# EAGLE design WFT0750CZ09_conv (EAGLE 7.7.0)
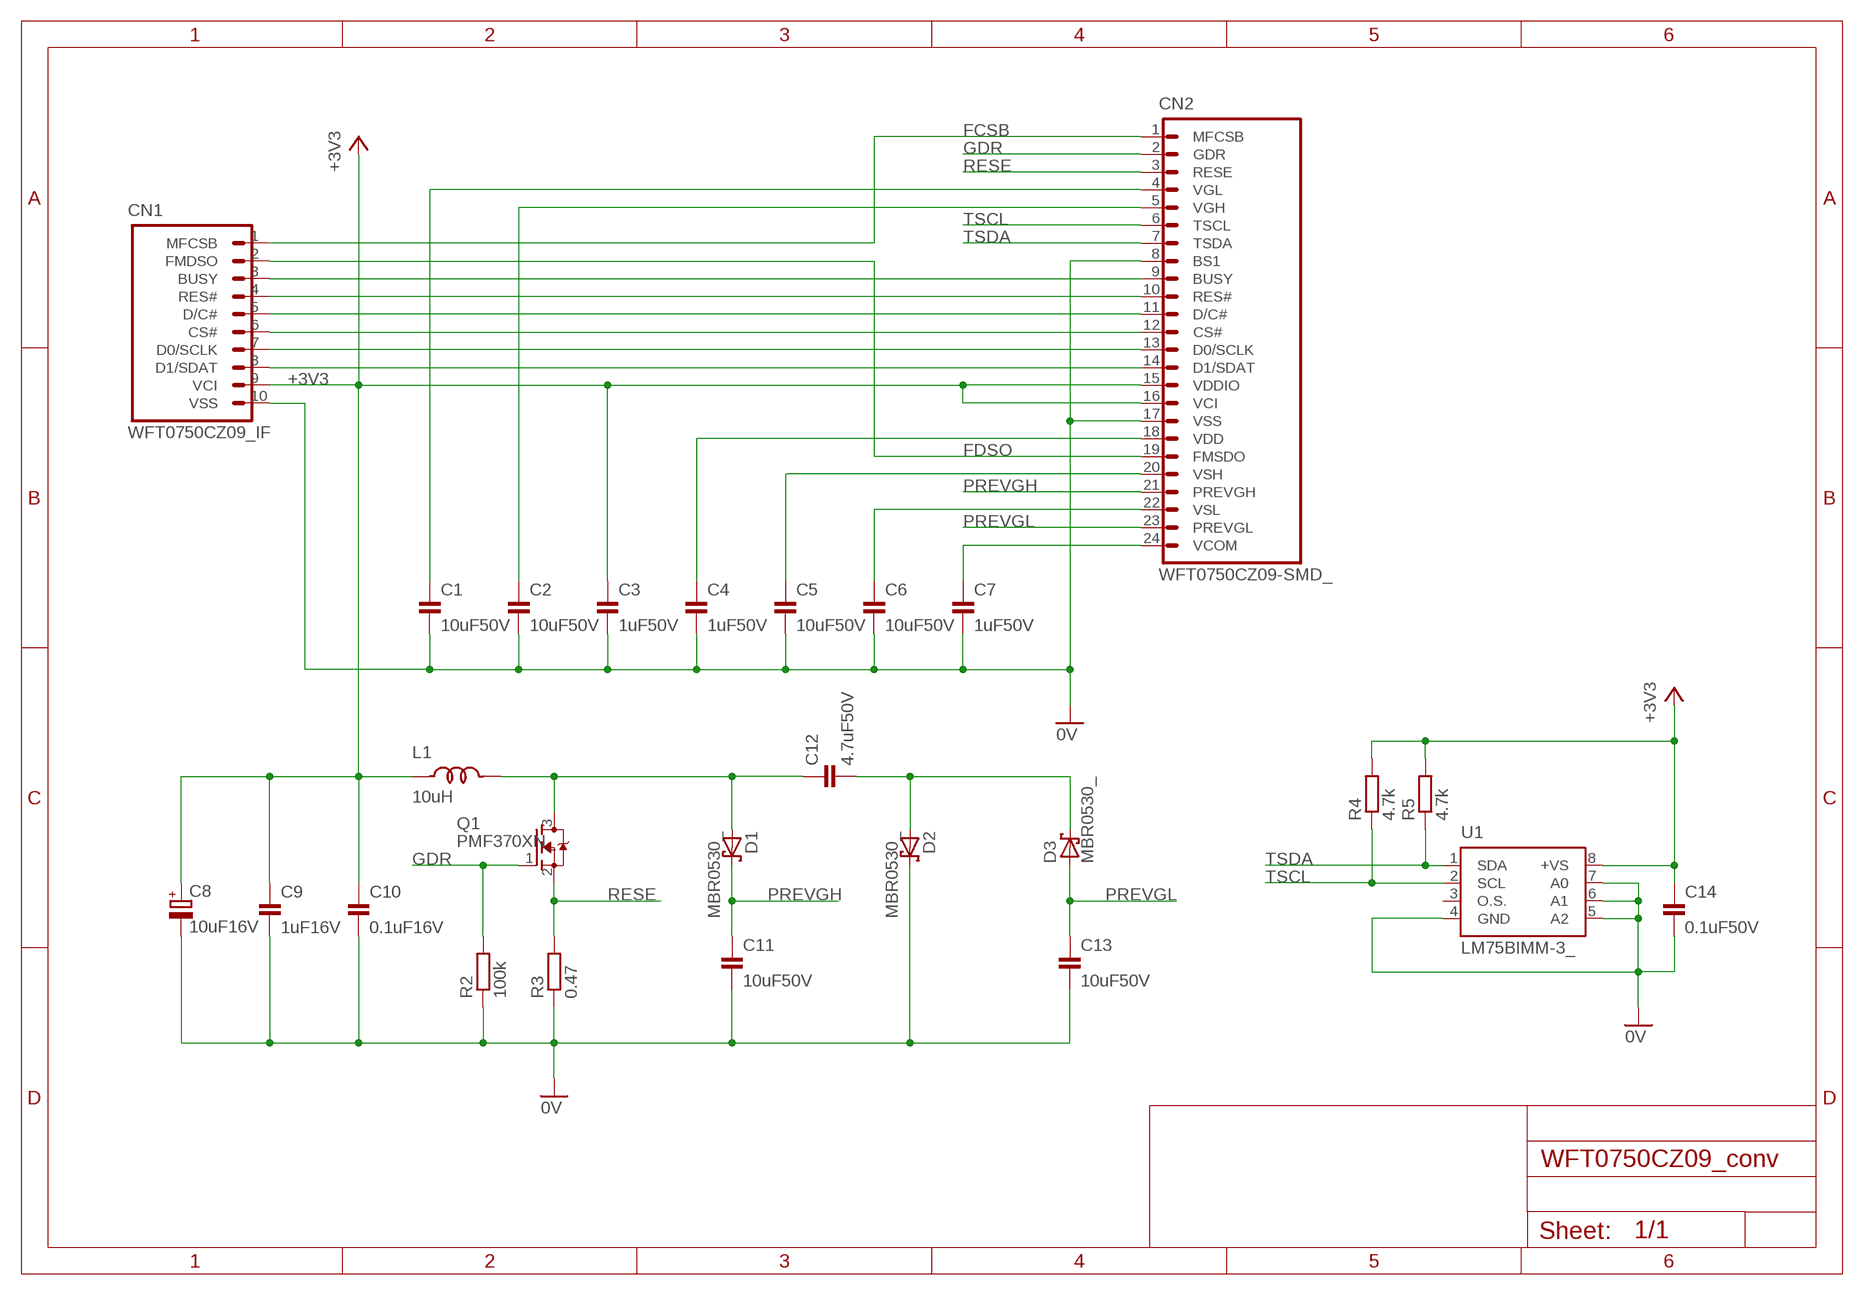
[diagram p0: schematic, sheet 1]

## Parts
C1  10uF50V  CAP_0805  [SMD_2012]
C2  10uF50V  CAP_0805  [SMD_2012]
C3  1uF50V  CAP_0805  [SMD_2012]
C4  1uF50V  CAP_0805  [SMD_2012]
C5  10uF50V  CAP_0805  [SMD_2012]
C6  10uF50V  CAP_0805  [SMD_2012]
C7  1uF50V  CAP_0805  [SMD_2012]
C8  10uF16V  TPST106K016R0800_  [C1210_TPST_DEV]
C9  1uF16V  CAP_0805  [SMD_2012]
C10  0.1uF16V  CAP_0805  [SMD_2012]
C11  10uF50V  CAP_0805  [SMD_2012]
C12  4.7uF50V  CAP_0805  [SMD_2012]
C13  10uF50V  CAP_0805  [SMD_2012]
C14  0.1uF50V  CAP_0805  [SMD_2012]
CN1  WFT0750CZ09_IF  [WFT0750CZ09_IF_10PIN]
CN2  WFT0750CZ09-SMD_  [FH12A-24S-0.5SH_DEV]
D1  MBR0530_  [MBR0530_DEV]
D2  MBR0530_  [MBR0530_DEV]
D3  MBR0530_  [MBR0530_DEV]
L1  10uH  NLCV25T_  [NLCV25T_DEV]
Q1  PMF370XN_  [SOT323_DEV]
R2  100k  RESISTOR_0805  [SMD_2012]
R3  0.47  RESISTOR_0805  [SMD_2012]
R4  4.7k  RESISTOR_0805  [SMD_2012]
R5  4.7k  RESISTOR_0805  [SMD_2012]
U1  LM75BIMM-3_  [SSOP8-DGK_DEV]

## Nets
0V: C1.2 C2.2 C3.2 C4.2 C5.2 C6.2 C7.2 C8.2(-) C9.2 C10.2 C11.2 C13.2 C14.2 CN1.10(VSS) CN2.8(BS1) CN2.17(VSS) D2.1(C) R2.1 R3.1 U1.4(GND) U1.5(A2) U1.6(A1) U1.7(A0)
+3V3: C3.1 C8.1(+) C9.1 C10.1 C14.1 CN1.9(VCI) CN2.15(VDDIO) CN2.16(VCI) L1.1 R4.2 R5.2 U1.8(+VS)
FCSB: CN1.1(MFCSB) CN2.1(MFCSB)
FDSO: CN1.2(FMDSO) CN2.19(FMSDO)
GDR: CN2.2(GDR) Q1.1(G) R2.2
N$1: C7.1 CN2.24(VCOM)
N$2: C6.1 CN2.22(VSL)
N$3: C5.1 CN2.20(VSH)
N$5: C4.1 CN2.18(VDD)
N$6: C12.1 D1.2(A) L1.2 Q1.3(D)
N$7: C2.1 CN2.5(VGH)
N$8: C1.1 CN2.4(VGL)
N$9: CN1.3(BUSY) CN2.9(BUSY)
N$10: CN1.4(RES#) CN2.10(RES#)
N$11: CN1.5(D/C#) CN2.11(D/C#)
N$12: CN1.6(CS#) CN2.12(CS#)
N$13: CN1.7(D0/SCLK) CN2.13(D0/SCLK)
N$14: CN1.8(D1/SDAT) CN2.14(D1/SDAT)
N$15: C12.2 D2.2(A) D3.1(C)
PREVGH: C11.1 CN2.21(PREVGH) D1.1(C)
PREVGL: C13.1 CN2.23(PREVGL) D3.2(A)
RESE: CN2.3(RESE) Q1.2(S) R3.2
TSCL: CN2.6(TSCL) R4.1 U1.2(SCL)
TSDA: CN2.7(TSDA) R5.1 U1.1(SDA)
Unconnected: U1.3(O.S.)

## Library data of the parts
C1-C7 C9-C14 = Parts:CAP: コンデンサー
C8 = Parts:TPST*: タンタルコンデンサ TPST106K016R0800 10µF ±10% 16V ESR（等価直列抵抗）: 0.8オーム 動作温度 : -55°C～125°C サイズ : 3.50mm x 2.80mm
CN1 = PartsForProto:WFT0750CZ09_IF: WF0420CZ15変換基板用I/F
CN2 = PartsForProto:WFT0750CZ09: インターフェースピン
D1-D3 = Parts:MBR0530: ショットキーダイオード
L1 = Parts:NLCV*: LEAD INDUCTOR
Q1 = Parts:PMF370XN: N-Channel 30 V (D-S) MOSFET
R2-R5 = Parts:RESISTOR: 抵抗器
U1 = Parts:LM75B*: 基板取付型温度センサー

## Board
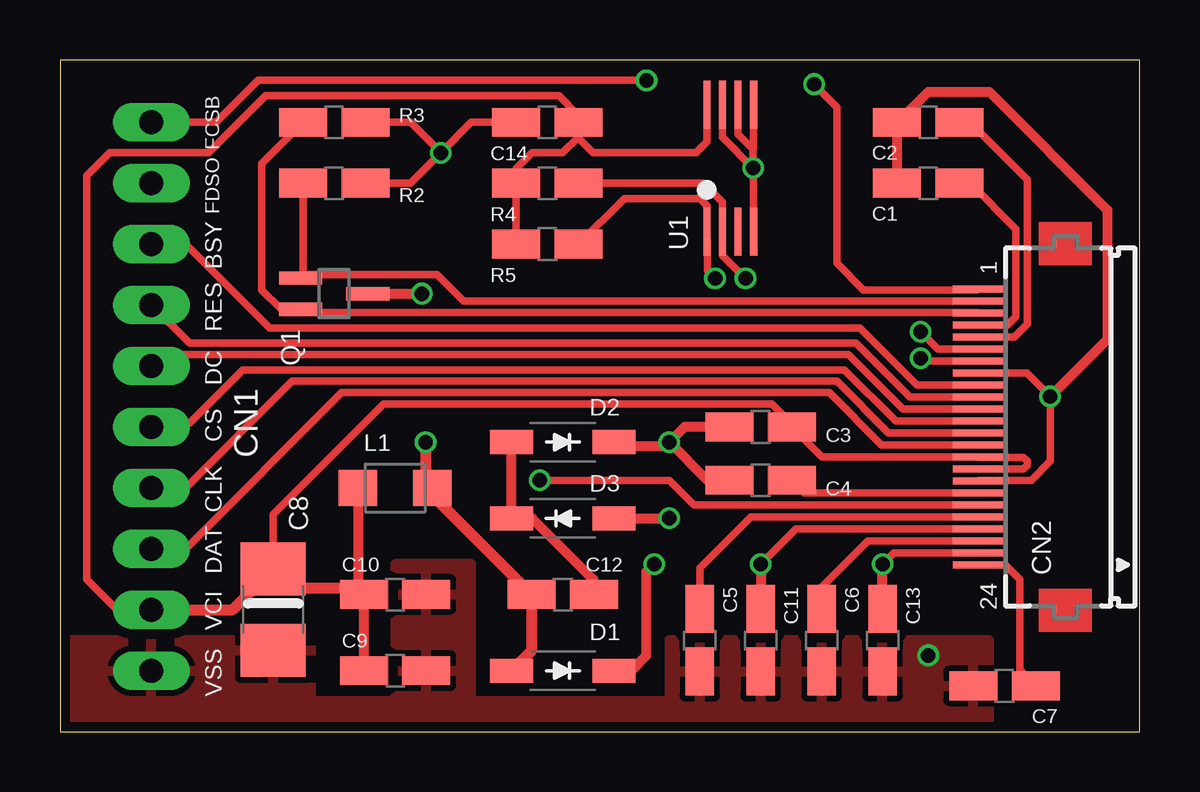
[diagram p1: board, top side]
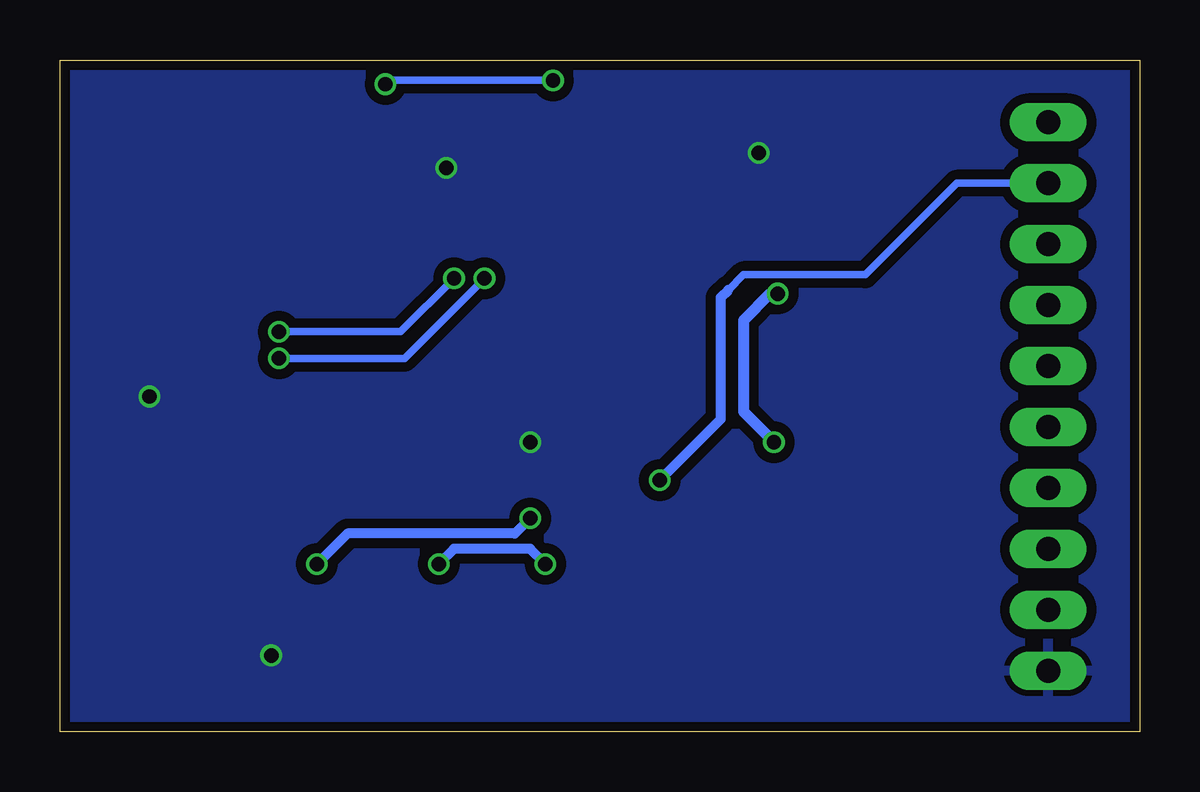
[diagram p2: board, bottom side, seen from below]

Size 45 x 28 mm. Coordinates in mm from the lower left corner, seen from the top.
Outline: 0,0 45,0 45,28 0,28 0,0
Copper layers (1*16): Top 0.035mm / dielectric 1.5mm / Bottom 0.035mm
Design rules "SeeedStudio_2layer_DRU_no_angle_20140221": minimum track width 6mil, minimum drill 12mil, track to track 6mil, track to pad 6mil, pad to pad 6mil, via to via 6mil, smd to smd 0mil, copper to edge 10mil, drill to drill 10mil, minimum pad ring 10mil, minimum via ring 6mil, stop-mask expansion 2mil, vias tented up to drill 100mil, thermal gap 10mil

### Footprints (pad centres in the part's own frame; a part is rotated, then mirrored left to right if it is on the bottom)
SMD_2012 = smd 2 x 1.2: 1 -1.3,0; 2 1.3,0
C1210_TPST_DEV = smd 2.2 x 2.7: 1 -1.7,0; 2 1.7,0
WFT0750CZ09_IF_10PIN = drill 1 pad 1.6 long: 1 0,0; 2 2.54,0; 3 5.08,0; 4 7.62,0; 5 10.16,0; 6 12.7,0; 7 15.24,0; 8 17.78,0; 9 20.32,0; 10 22.86,0
FH12A-24S-0.5SH_DEV = smd 0.3 x 2.1: 1 5.75,3.65; 2 5.25,3.65; 3 4.75,3.65; 4 4.25,3.65; 5 3.75,3.65; 6 3.25,3.65; 7 2.75,3.65; 8 2.25,3.65; 9 1.75,3.65; 10 1.25,3.65; 11 0.75,3.65; 12 0.25,3.65; 13 -0.25,3.65; 14 -0.75,3.65; 15 -1.25,3.65; 16 -1.75,3.65; 17 -2.25,3.65; 18 -2.75,3.65; 19 -3.25,3.65; 20 -3.75,3.65; 21 -4.25,3.65; 22 -4.75,3.65; 23 -5.25,3.65; 24 -5.75,3.65
MBR0530_DEV = smd 1.8 x 1: 1 -2.135,0; 2 2.135,0
NLCV25T_DEV = smd 1.6 x 1.5: 1 -1.55,0; 2 1.55,0
SOT323_DEV = smd 0.56 x 1.8: 1 -0.65,-1.4; 2 0.65,-1.4; 3 0,1.4
SSOP8-DGK_DEV = smd 0.3 x 2: 1 -0.975,-2.65; 2 -0.325,-2.65; 3 0.325,-2.65; 4 0.975,-2.65; 5 0.975,2.65; 6 0.325,2.65; 7 -0.325,2.65; 8 -0.975,2.65

### Placement (x,y rotation side)
C1  36.2,22.86 180 top
C2  36.2,25.4 180 top
C3  29.21,12.7 180 top
C4  29.21,10.48 180 top
C5  26.67,3.81 270 top
C6  31.75,3.81 270 top
C7  39.37,1.91 180 top
C8  8.89,5.08 270 top
C9  13.97,2.54 0 top
C10  13.97,5.71 0 top
C11  29.21,3.81 270 top
C12  20.95,5.71 0 top
C13  34.29,3.81 270 top
C14  20.32,25.4 180 top
CN1  3.81,25.4 270 top
CN2  41.91,12.7 90 top
D1  20.95,2.54 180 top
D2  20.95,12.06 180 top
D3  20.95,8.89 0 top
L1  13.97,10.16 0 top
Q1  11.43,18.26 270 top
R2  11.43,22.86 180 top
R3  11.43,25.4 180 top
R4  20.32,22.86 180 top
R5  20.32,20.32 180 top
U1  27.94,23.5 0 top

### Tracks (layer width: path | path; a pad name or v marks a point on that pad's centre or on a via)
0V  (via drill 0.6)
  Top 0.305: CN2.8 40.3,14.95 v41.27,13.97 41.27,11.27 40.48,10.48 38.29,10.48 CN2.17 | R3.1 14.61,25.4 v15.88,24.13 | R2.1 14.61,22.86 v15.88,24.13 | v15.88,24.13 17.14,25.4 C14.2 | U1.4 28.91,23.47 v28.89,23.5 | U1.7 27.61,24.77 v28.89,23.5 | U1.6 28.27,24.92 28.89,24.29 | 28.89,24.29 v28.89,23.5 | U1.5 28.91,24.31 28.89,24.29
  Top 0.406: D2.1 23.25,11.91 25.24,11.91 v25.4,12.06 | v41.27,13.97 43.66,16.35 43.66,21.75 38.73,26.67 36.2,26.67 34.92,25.4 C2.2 C1.2 | C3.2 26.04,12.7 v25.4,12.06 | C4.2 26.99,10.48 v25.4,12.06
  other vias: 36.2,3.17
  pour Bottom (isolate 0.406): -1.27,29.21 46.35,29.21 46.35,-0.79 -1.27,-0.79
  pour Top (isolate 0.406): -0.64,-0.64 38.73,-0.64 38.73,3.81 25.4,3.81 25.4,1.27 17.14,1.27 17.14,6.99 13.97,6.99 13.97,1.27 10.48,1.27 10.48,3.81 -0.64,3.81
+3V3
  Top 0.305: CN1.9 2.38,5.08 1.11,6.35 1.11,23.18 2.06,24.13 6.19,24.13 8.57,26.51 20.8,26.51 21.62,25.69 C14.1 21.59,25.37 21.59,24.77 | R5.2 R4.2 19.02,23.46 19.68,24.13 20.95,24.13 21.59,24.77 | U1.8 26.96,24.58 26.51,24.13 22.23,24.13 21.59,24.77 | CN2.16 40.16,10.95 40.32,11.11 40.32,11.27 40.16,11.43 38.28,11.43 CN2.15 31.76,11.45 C3.1 30.51,12.83 29.69,13.65 13.49,13.65 8.89,9.05 C8.1
  Top 0.406: C9.1 C10.1 12.42,5.96 L1.1
  Top 0.457: 12.67,10.11 L1.1 | 12.42,5.96 9.71,5.96 C8.1 7.19,5.08 CN1.9
FCSB  (via drill 0.6)
  Top 0.305: CN1.1 6.51,25.4 8.26,27.15 v24.45,27.15 | v31.43,26.99 32.38,26.04 32.38,19.53 33.5,18.41 38.23,18.41 CN2.1
  Bottom 0.305: v24.45,27.15 31.27,27.15 v31.43,26.99
FDSO  (via drill 0.6)
  Top 0.305: CN2.19 26.43,9.45 25.4,10.48 v20,10.48
  Bottom 0.305: CN1.2 7.62,22.86 11.43,19.05 16.51,19.05 17.14,18.41
  Bottom 0.406: 17.14,18.41 17.46,18.1 17.46,13.02 v20,10.48
GDR
  Top 0.305: CN2.2 16.83,17.94 15.72,19.05 10.17,19.05 Q1.1 10.13,19.01 R2.2
N$1
  Top 0.305: CN2.24 39.41,6.95 40.01,6.35 40.01,2.57 C7.1
N$2
  Top 0.305: CN2.22 33.67,7.95 31.75,6.03 C6.1
N$3
  Top 0.305: CN2.20 28.79,8.95 26.67,6.83 C5.1
N$5
  Top 0.305: CN2.18 31.04,9.95 C4.1
N$6  (via drill 0.6)
  Top 0.406: Q1.3 v15.08,18.26
  Top 0.457: D1.2 19.66,3.38 C12.1 15.32,10.05 L1.2 15.24,10.24 v15.24,12.06
  Bottom 0.457: v15.08,18.26 15.4,18.26 16.51,17.14 16.51,13.34 v15.24,12.06
N$7
  Top 0.305: CN2.5 39.79,16.45 40.32,16.99 40.32,23.02 38.1,25.24 37.65,25.24 C2.1
N$8
  Top 0.305: CN2.4 39.49,16.95 39.85,17.3 39.85,20.95 37.94,22.86 C1.1
N$9
  Top 0.305: CN2.9 35.72,14.45 33.34,16.83 8.73,16.83 5.24,20.32 CN1.3
N$10
  Top 0.305: CN2.10 35.42,13.95 33.18,16.19 5.4,16.19 CN1.4
N$11
  Top 0.305: CN2.11 35.13,13.45 32.86,15.72 4.29,15.72 CN1.5
N$12
  Top 0.305: CN2.12 34.83,12.95 32.7,15.08 7.62,15.08 5.4,12.86 3.97,12.86 CN1.6
N$13
  Top 0.305: CN2.13 34.54,12.45 32.38,14.61 9.68,14.61 5.24,10.16 CN1.7
N$14
  Top 0.305: CN2.14 34.25,11.95 32.07,14.13 11.75,14.13 5.24,7.62 CN1.8
N$15
  Top 0.406: D2.2 D3.1 19.68,8.89 22.23,6.35 22.23,5.75 C12.2
PREVGH  (via drill 0.6)
  Top 0.305: CN2.21 30.68,8.45 v29.21,6.99
  Top 0.406: D1.1 23.81,2.54 24.45,3.17 24.45,6.67 v24.77,6.99 | v29.21,6.99 C11.1
  Bottom 0.406: v24.77,6.99 25.4,7.62 28.57,7.62 v29.21,6.99
PREVGL  (via drill 0.6)
  Top 0.305: 34.32,5.08 C13.1 | CN2.23 34.76,7.45 v34.29,6.99
  Top 0.406: C13.1 v34.29,6.99 | D3.2 v25.4,8.89
  Bottom 0.406: v34.29,6.99 33.02,8.26 26.04,8.26 v25.4,8.89
RESE
  Top 0.305: CN2.3 38.25,17.46 10.17,17.46 Q1.2 9.22,17.61 8.41,18.41 8.41,23.68 R3.2
TSCL  (via drill 0.6)
  Top 0.305: R4.1 26.83,22.86 27.62,22.07 U1.2 27.62,20.84 27.62,19.84 v28.57,18.89 | CN2.6 36.6,15.95 v35.88,16.67
  Bottom 0.305: v35.88,16.67 30.8,16.67 v28.57,18.89
TSDA  (via drill 0.6)
  Top 0.305: R5.1 23.52,22.23 26.67,22.23 26.96,21.93 U1.1 26.99,20.23 26.99,19.21 v27.3,18.89 | v35.88,15.56 35.98,15.45 CN2.7
  Bottom 0.305: v27.3,18.89 30.64,15.56 v35.88,15.56